# EAGLE board CFT-PB3-revC (EAGLE 7.6.0), part 1 of 2
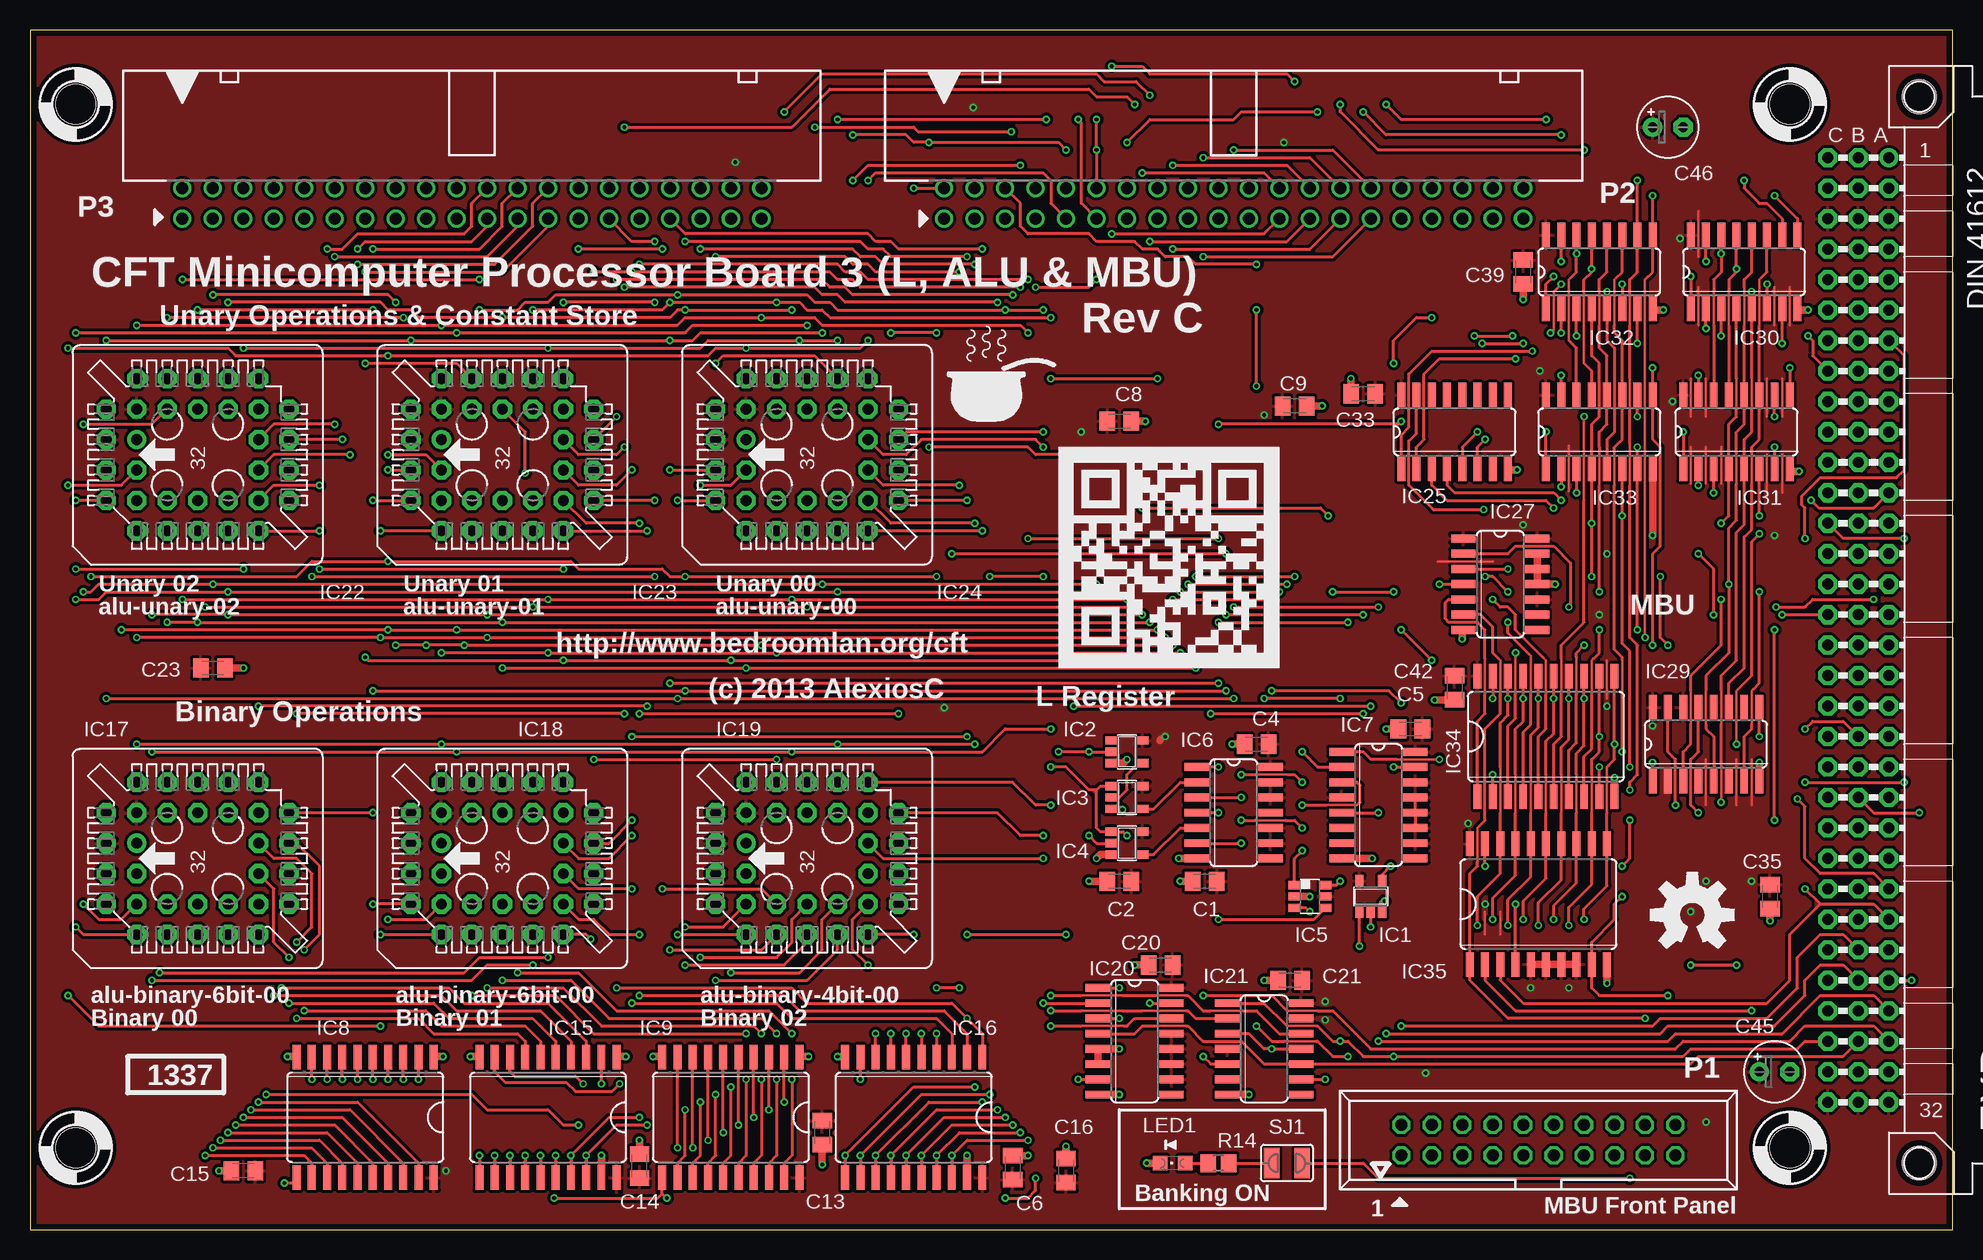
[diagram p7: board, top side]
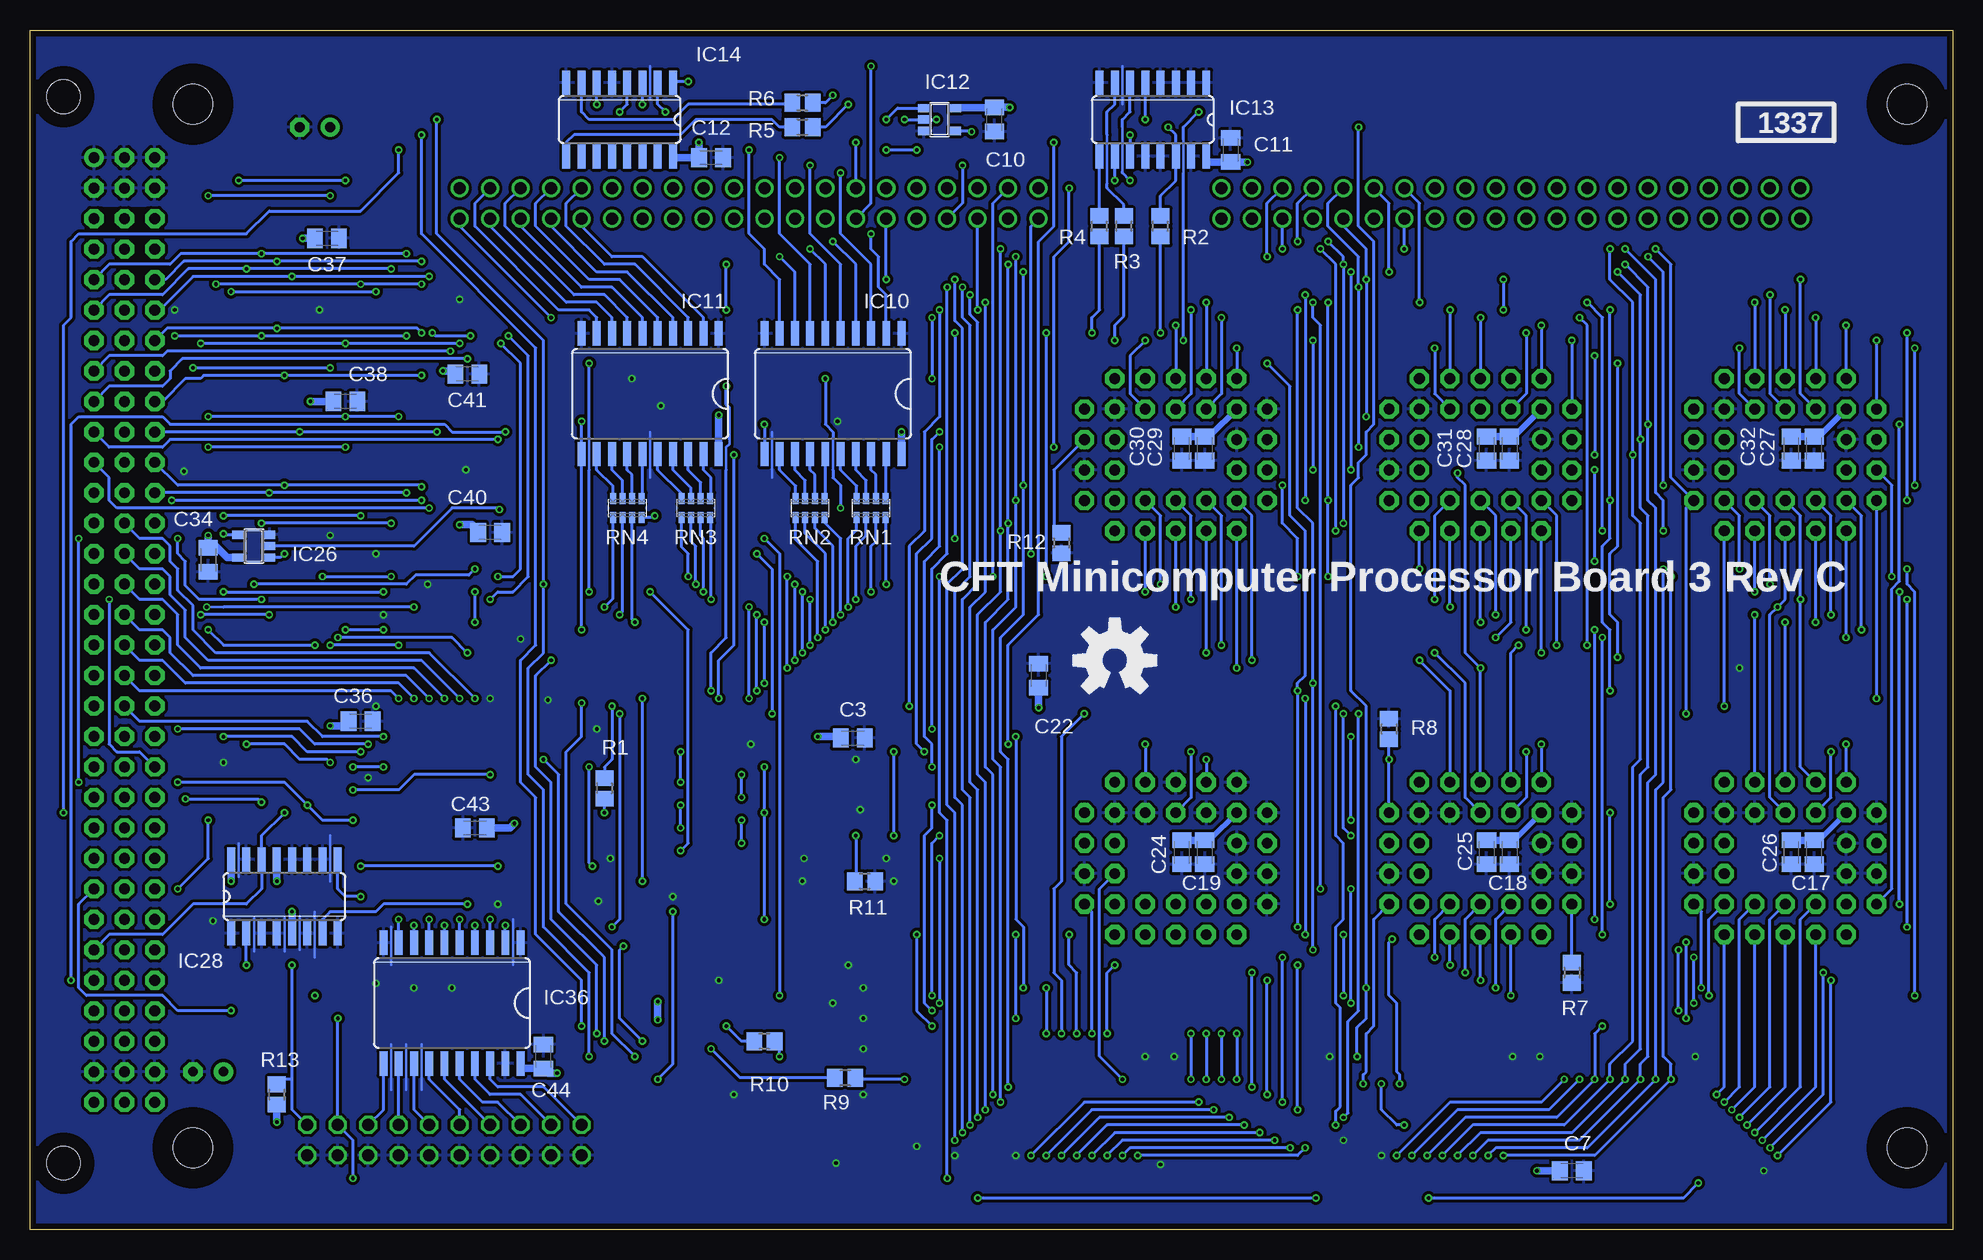
[diagram p8: board, bottom side, seen from below]

Size 160.27 x 100.03 mm. Coordinates in mm from the lower left corner, seen from the top.
Copper layers (1*16): Top 0.035mm / dielectric 1.5mm / Bottom 0.035mm
Design rules "smart-prototyping *": minimum track width 7mil, minimum drill 12mil, track to track 7mil, track to pad 7mil, pad to pad 7mil, via to via 7mil, smd to smd 0mil, copper to edge 20mil, drill to drill 10mil, minimum pad ring 10mil, minimum via ring 6mil, stop-mask expansion 2mil, vias tented up to drill 25mil, thermal gap 10mil
Net classes: 0 default: width 0.254 mm, clearance 0.152 mm; 1 Thin: width 0.203 mm, clearance 0.152 mm; 2 Power Rail: width 0.61 mm, clearance 0.152 mm
bRestrict: area 150.5,83.8 to 154.3,85.1

## Footprints (pad centres in the part's own frame; a part is rotated, then mirrored left to right if it is on the bottom)
C0805K = smd 1.3 x 1.6: 1 -1,0; 2 1,0
E2,5-5 = drill 0.813 pad 1.6 round: + -1.27,0 | drill 0.813 pad 1.6 octagon: - 1.27,0
VG96K = drill 0.914 pad 1.6 round: A1 154.94,39.37 | drill 0.914 pad 1.6 octagon: A2 154.94,36.83; A3 154.94,34.29; A4 154.94,31.75; A5 154.94,29.21; A6 154.94,26.67; A7 154.94,24.13; A8 154.94,21.59; A9 154.94,19.05; A10 154.94,16.51; A11 154.94,13.97; A12 154.94,11.43; A13 154.94,8.89; A14 154.94,6.35; A15 154.94,3.81; A16 154.94,1.27; A17 154.94,-1.27; A18 154.94,-3.81; A19 154.94,-6.35; A20 154.94,-8.89; A21 154.94,-11.43; A22 154.94,-13.97; A23 154.94,-16.51; A24 154.94,-19.05; A25 154.94,-21.59; A26 154.94,-24.13; A27 154.94,-26.67; A28 154.94,-29.21; A29 154.94,-31.75; A30 154.94,-34.29; A31 154.94,-36.83; A32 154.94,-39.37; B1 152.4,39.37; B2 152.4,36.83; B3 152.4,34.29; B4 152.4,31.75; B5 152.4,29.21; B6 152.4,26.67; B7 152.4,24.13; B8 152.4,21.59; B9 152.4,19.05; B10 152.4,16.51; B11 152.4,13.97; B12 152.4,11.43; B13 152.4,8.89; B14 152.4,6.35; B15 152.4,3.81; B16 152.4,1.27; B17 152.4,-1.27; B18 152.4,-3.81; B19 152.4,-6.35; B20 152.4,-8.89; B21 152.4,-11.43; B22 152.4,-13.97; B23 152.4,-16.51; B24 152.4,-19.05; B25 152.4,-21.59; B26 152.4,-24.13; B27 152.4,-26.67; B28 152.4,-29.21; B29 152.4,-31.75; B30 152.4,-34.29; B31 152.4,-36.83; B32 152.4,-39.37; C1 149.86,39.37; C2 149.86,36.83; C3 149.86,34.29; C4 149.86,31.75; C5 149.86,29.21; C6 149.86,26.67; C7 149.86,24.13; C8 149.86,21.59; C9 149.86,19.05; C10 149.86,16.51; C11 149.86,13.97; C12 149.86,11.43; C13 149.86,8.89; C14 149.86,6.35; C15 149.86,3.81; C16 149.86,1.27; C17 149.86,-1.27; C18 149.86,-3.81; C19 149.86,-6.35; C20 149.86,-8.89; C21 149.86,-11.43; C22 149.86,-13.97; C23 149.86,-16.51; C24 149.86,-19.05; C25 149.86,-21.59; C26 149.86,-24.13; C27 149.86,-26.67; C28 149.86,-29.21; C29 149.86,-31.75; C30 149.86,-34.29; C31 149.86,-36.83; C32 149.86,-39.37 | hole 2.794: 157.48,44.45; 157.48,-44.45
SOT23-5 = smd 0.69 x 0.99: 1 -0.95,-1.29; 2 0,-1.29; 3 0.95,-1.29; 4 0.95,1.3; 5 -0.95,1.3
DBV_R-PDSO-G6 = smd 0.69 x 0.99: 1 -0.95,-1.29; 2 0,-1.29; 3 0.95,-1.29; 4 0.95,1.3; 5 0,1.3; 6 -0.95,1.3
SO14 = smd 0.66 x 2.032: 1 -3.81,-3.073; 2 -2.54,-3.073; 3 -1.27,-3.073; 4 0,-3.073; 5 1.27,-3.073; 6 2.54,-3.073; 7 3.81,-3.073; 8 3.81,3.073; 9 2.54,3.073; 10 1.27,3.073; 11 0,3.073; 12 -1.27,3.073; 13 -2.54,3.073; 14 -3.81,3.073
SO16 = smd 0.66 x 2.032: 1 -4.445,-3.073; 2 -3.175,-3.073; 3 -1.905,-3.073; 4 -0.635,-3.073; 5 0.635,-3.073; 6 1.905,-3.073; 7 3.175,-3.073; 8 4.445,-3.073; 9 4.445,3.073; 10 3.175,3.073; 11 1.905,3.073; 12 0.635,3.073; 13 -0.635,3.073; 14 -1.905,3.073; 15 -3.175,3.073; 16 -4.445,3.073
SO20W = smd 0.66 x 2.032: 1 -5.715,-5.029; 2 -4.445,-5.029; 3 -3.175,-5.029; 4 -1.905,-5.029; 5 -0.635,-5.029; 6 0.635,-5.029; 7 1.905,-5.029; 8 3.175,-5.029; 9 4.445,-5.029; 10 5.715,-5.029; 11 5.715,5.029; 12 4.445,5.029; 13 3.175,5.029; 14 1.905,5.029; 15 0.635,5.029; 16 -0.635,5.029; 17 -1.905,5.029; 18 -3.175,5.029; 19 -4.445,5.029; 20 -5.715,5.029
PLCC32 = drill 0.9 pad 1.6 round: 1 1.27,5.08 | drill 0.9 pad 1.6 octagon: 2 -1.27,7.62; 3 -1.27,5.08; 4 -3.81,7.62; 5 -6.35,5.08; 6 -3.81,5.08; 7 -6.35,2.54; 8 -3.81,2.54; 9 -6.35,0; 10 -3.81,0; 11 -6.35,-2.54; 12 -3.81,-2.54; 13 -6.35,-5.08; 14 -3.81,-7.62; 15 -3.81,-5.08; 16 -1.27,-7.62; 17 -1.27,-5.08; 18 1.27,-7.62; 19 1.27,-5.08; 20 3.81,-7.62; 21 6.35,-5.08; 22 3.81,-5.08; 23 6.35,-2.54; 24 3.81,-2.54; 25 6.35,0; 26 3.81,0; 27 6.35,2.54; 28 3.81,2.54; 29 6.35,5.08; 30 3.81,7.62; 31 3.81,5.08; 32 1.27,7.62
CHIPLED_0805 = smd 1.2 x 1.2: A 0,-1.05; C 0,1.05
057-020-1 = drill 1 octagon: 1 -11.43,-1.27; 2 -11.43,1.27; 3 -8.89,-1.27; 4 -8.89,1.27; 5 -6.35,-1.27; 6 -6.35,1.27; 7 -3.81,-1.27; 8 -3.81,1.27; 9 -1.27,-1.27; 10 -1.27,1.27; 11 1.27,-1.27; 12 1.27,1.27; 13 3.81,-1.27; 14 3.81,1.27; 15 6.35,-1.27; 16 6.35,1.27; 17 8.89,-1.27; 18 8.89,1.27; 19 11.43,-1.27; 20 11.43,1.27
PAK100/2500-5-40 = drill 1 pad 1.422 round: 1 -24.13,-1.27; 2 -24.13,1.27; 3 -21.59,-1.27; 4 -21.59,1.27; 5 -19.05,-1.27; 6 -19.05,1.27; 7 -16.51,-1.27; 8 -16.51,1.27; 9 -13.97,-1.27; 10 -13.97,1.27; 11 -11.43,-1.27; 12 -11.43,1.27; 13 -8.89,-1.27; 14 -8.89,1.27; 15 -6.35,-1.27; 16 -6.35,1.27; 17 -3.81,-1.27; 18 -3.81,1.27; 19 -1.27,-1.27; 20 -1.27,1.27; 21 1.27,-1.27; 22 1.27,1.27; 23 3.81,-1.27; 24 3.81,1.27; 25 6.35,-1.27; 26 6.35,1.27; 27 8.89,-1.27; 28 8.89,1.27; 29 11.43,-1.27; 30 11.43,1.27; 31 13.97,-1.27; 32 13.97,1.27; 33 16.51,-1.27; 34 16.51,1.27; 35 19.05,-1.27; 36 19.05,1.27; 37 21.59,-1.27; 38 21.59,1.27; 39 24.13,-1.27; 40 24.13,1.27
R0805 = smd 1.3 x 1.5: 1 -0.85,0; 2 0.85,0
CTS742C083 = smd 0.5 x 0.9: 1 -1.2,-0.8; 2 -0.4,-0.8; 3 0.4,-0.8; 4 1.2,-0.8; 5 1.2,0.8; 6 0.4,0.8; 7 -0.4,0.8; 8 -1.2,0.8
SJW = smd 1.27 x 2.54: 1 -1.27,0; 2 1.27,0
STANDOFF_28_60 = hole 3.302: 0,0

## Placement (x,y rotation side)
$4_37_$  SIGNATURESILK  [SIGNATURE]  76.83,67.16 0 top
$4_39_$  OSHW-LOGOL  [OSHW-LOGO-L]  69.85,47.47 0 bottom
$4_39_$1  OSHW-LOGOL  [OSHW-LOGO-L]  138.56,26.26 0 top
$4_40_$  QRCODE-CFT  [CFT-QRCODE]  85.72,46.84 0 top
C1  0.1uF  [C0805K]  97.92,29.06 0 top
C2  0.1uF  [C0805K]  90.81,29.06 0 top
C3  0.1uF  [C0805K]  91.69,41 180 bottom
C4  0.1uF  [C0805K]  102.23,40.49 0 top
C5  0.1uF  [C0805K]  115.06,41.76 0 top
C6  0.1uF  [C0805K]  81.92,5.18 270 top
C7  0.1uF  [C0805K]  31.75,4.93 180 bottom
C8  0.1uF  [C0805K]  90.81,67.41 180 top
C9  0.1uF  [C0805K]  105.41,68.68 180 top
C10  0.1uF  [C0805K]  79.88,92.56 90 bottom
C11  0.1uF  [C0805K]  60.2,90.02 270 bottom
C12  0.1uF  [C0805K]  103.5,89.38 180 bottom
C13  0.1uF  [C0805K]  66.04,8.1 90 top
C14  0.1uF  [C0805K]  50.8,5.31 270 top
C15  1uF  [C0805K]  17.78,4.93 180 top
C16  1uF  [C0805K]  86.36,4.93 90 top
C17  0.1uF  [C0805K]  11.56,31.47 90 bottom
C18  0.1uF  [C0805K]  36.96,31.47 90 bottom
C19  0.1uF  [C0805K]  62.36,31.47 90 bottom
C20  0.1uF  [C0805K]  94.23,22.07 0 top
C21  0.1uF  [C0805K]  105.03,20.8 0 top
C22  1uF  [C0805K]  76.2,46.2 90 bottom
C23  1uF  [C0805K]  15.24,46.84 0 top
C24  1uF  [C0805K]  64.26,31.47 270 bottom
C25  1uF  [C0805K]  38.86,31.47 270 bottom
C26  1uF  [C0805K]  13.46,31.47 270 bottom
C27  0.1uF  [C0805K]  11.56,65.13 90 bottom
C28  0.1uF  [C0805K]  36.96,65.13 90 bottom
C29  0.1uF  [C0805K]  62.36,65.13 90 bottom
C30  1uF  [C0805K]  64.26,65.13 270 bottom
C31  1uF  [C0805K]  38.86,65.13 270 bottom
C32  1uF  [C0805K]  13.46,65.13 270 bottom
C33  0.1uF  [C0805K]  111.12,69.7 0 top
C34  0.1uF  [C0805K]  145.41,55.85 90 bottom
C35  0.1uF  [C0805K]  145.03,27.79 90 top
C36  0.1uF  [C0805K]  132.72,42.39 180 bottom
C37  0.1uF  [C0805K]  135.51,82.65 180 bottom
C38  0.1uF  [C0805K]  133.99,69.06 180 bottom
C39  0.1uF  [C0805K]  124.46,79.86 90 top
C40  0.1uF  [C0805K]  121.92,58.14 180 bottom
C41  0.1uF  [C0805K]  123.83,71.35 180 bottom
C42  0.1uF  [C0805K]  118.75,45.19 90 top
C43  0.1uF  [C0805K]  123.19,33.5 0 bottom
C44  0.1uF  [C0805K]  117.47,14.45 270 bottom
C45  47uF  [E2,5-5]  145.41,13.18 0 top
C46  47uF  [E2,5-5]  136.53,91.92 0 top
EXP  [VG96K]  0,50.01 0 top
IC1  74AHC1G08DBV  [SOT23-5]  111.76,27.79 0 top
IC2  74AHC1G04DBV  [SOT23-5]  91.44,39.85 270 top
IC3  74AHC1G08DBV  [SOT23-5]  91.44,36.04 270 top
IC4  74AHC1G00DBV  [SOT23-5]  91.44,32.23 270 top
IC5  741G10DBV  [DBV_R-PDSO-G6]  106.68,27.79 270 top
IC6  74HC32D  [SO14]  100.33,34.77 270 top
IC7  74HC112D  [SO16]  112.39,35.41 270 top
IC8  74HC574D  [SO20W]  27.94,9.37 180 top
IC9  74HC574D  [SO20W]  58.42,9.37 180 top
IC10  74HC574D  [SO20W]  93.34,69.7 180 bottom
IC11  74HC574D  [SO20W]  108.58,69.7 180 bottom
IC12  74AHC1G32DBV  [SOT23-5]  84.45,92.56 270 bottom
IC13  74HC253D  [SO16]  66.67,92.56 180 bottom
IC14  74HC138D  [SO16]  111.12,92.56 180 bottom
IC15  74HC541DW  [SO20W]  43.18,9.37 180 top
IC16  74HC541DW  [SO20W]  73.66,9.37 180 top
IC17  29F040  [PLCC32]  13.97,30.96 90 top
IC18  29F040  [PLCC32]  39.37,30.96 90 top
IC19  29F040  [PLCC32]  64.77,30.96 90 top
IC20  74HC253D  [SO16]  92.08,15.72 270 top
IC21  74HC74D  [SO14]  102.87,15.09 270 top
IC22  29F040  [PLCC32]  13.97,64.62 90 top
IC23  29F040  [PLCC32]  39.37,64.62 90 top
IC24  29F040  [PLCC32]  64.77,64.62 90 top
IC25  74HC138D  [SO16]  118.75,66.52 0 top
IC26  74AHC1G08DBV  [SOT23-5]  141.6,57 90 bottom
IC27  74HC74D  [SO14]  122.56,53.82 270 top
IC28  74HC253D  [SO16]  139.06,27.79 0 bottom
IC29  74HC139D  [SO16]  139.7,40.49 0 top
IC30  74HC670D  [SO16]  142.88,79.86 0 top
IC31  74HC670D  [SO16]  142.24,66.52 0 top
IC32  74HC670D  [SO16]  130.81,79.86 0 top
IC33  74HC670D  [SO16]  130.81,66.52 0 top
IC34  74HC541DW  [SO20W]  126.36,41.12 0 top
IC35  74HC541DW  [SO20W]  125.73,27.15 0 top
IC36  74HC541DW  [SO20W]  125.09,18.9 180 bottom
LED1  LED-5MM-GREEN  [CHIPLED_0805]  95.25,5.56 90 top
P1  057-020-1  [057-020-1]  125.73,7.47 0 top
P2  2540-5  [PAK100/2500-5-40]  100.33,85.57 0 top
P3  2540-5  [PAK100/2500-5-40]  36.83,85.57 0 top
R1  30R  [R0805]  112.39,36.8 270 bottom
R2  30R  [R0805]  66.04,83.67 90 bottom
R3  30R  [R0805]  69.09,83.67 90 bottom
R4  30R  [R0805]  71.12,83.67 90 bottom
R5  30R  [R0805]  95.89,91.92 0 bottom
R6  30R  [R0805]  95.89,93.95 0 bottom
R7  4k7  [R0805]  31.75,21.44 270 bottom
R8  4k7  [R0805]  46.99,41.76 90 bottom
R9  30R  [R0805]  92.33,12.67 180 bottom
R10  30R  [R0805]  99.06,15.72 180 bottom
R11  4k7  [R0805]  90.68,29.06 0 bottom
R12  4k7  [R0805]  74.3,57.25 270 bottom
R13  4k7  [R0805]  139.7,11.28 90 bottom
R14  330R  [R0805]  99.06,5.56 180 top
RN1  30R  [CTS742C083]  90.17,60.17 180 bottom
RN2  30R  [CTS742C083]  95.25,60.17 180 bottom
RN3  30R  [CTS742C083]  104.78,60.17 180 bottom
RN4  30R  [CTS742C083]  110.49,60.17 180 bottom
SJ1  [SJW]  104.78,5.56 180 top
U1  HOLE  [STANDOFF_28_60]  3.81,93.83 0 top
U2  HOLE  [STANDOFF_28_60]  3.81,6.83 0 top
U3  HOLE  [STANDOFF_28_60]  146.69,93.83 0 top
U4  HOLE  [STANDOFF_28_60]  146.69,6.83 0 top

## Tracks (layer width: path | path; a pad name or v marks a point on that pad's centre or on a via)
!ACCPL  (via drill 0.3)
  Top 0.254: v108.58,53.19 v113.67,53.19 | v113.67,72.24 113.67,74.14 115.57,76.05 v116.84,76.05 | IC5.1 105.41,28.76 105.41,30.96 v106.05,31.6
  Bottom 0.203: 113.67,63.35 113.67,66.01
  Bottom 0.254: v106.05,31.6 105.41,32.23 105.41,50.01 v108.58,53.19 | P2.39 124.46,83.67 v116.84,76.05 | 113.67,66.01 v113.67,72.24 | v113.67,53.19 113.67,63.35
!ALUCPL  (via drill 0.3)
  Top 0.203: 87.63,19.53 91.06,19.53 | 93.85,19.53 96.39,19.53 | 98.42,18.26 101.09,18.26
  Top 0.254: IC21.12 104.14,16.36 102.23,18.26 101.09,18.26 | v84.45,32.87 82.55,32.87 80.64,34.77 IC19.20 | v85.09,19.53 87.63,19.53 | 91.06,19.53 93.85,19.53 | 96.39,19.53 96.52,19.53 97.79,18.26 98.42,18.26
  Bottom 0.254: v85.09,19.53 85.09,32.23 v84.45,32.87
!BANKING
  Top 0.203: 121.28,44.68 121.28,47.6
  Top 0.254: IC34.1 120.65,42.39 121.28,43.03 121.28,44.68 | IC27.5 118.24,52.55 117.98,52.3 117.98,50.9 118.24,50.65 120.65,50.65 121.28,50.01 121.28,47.6
!BANKR0
  Top 0.203: 143.51,62.2 143.51,64.74 | 144.15,75.41 144.15,79.22 144.27,79.35
  Top 0.254: IC30.11 144.78,79.86 144.27,79.35 | 143.51,64.74 143.51,65.25 144.15,65.89 IC31.11 144.15,75.41 | 143.51,62.2 143.51,58.39 142.88,57.76 142.88,46.84 141.6,45.57 IC29.11
!BANKR1  (via drill 0.3)
  Top 0.203: 132.08,75.41 132.08,79.22 132.21,79.35 | 132.08,62.08 132.08,64.87 | 132.72,44.81 132.72,47.47
  Top 0.254: IC32.11 132.72,79.86 132.21,79.35 | 132.08,75.41 132.08,74.78 132.72,74.14 IC33.11 132.72,65.89 132.08,65.25 132.08,64.87 | v144.15,41.12 IC29.9 | 132.72,47.47 132.72,47.73 132.08,48.36 132.08,62.08 | v132.72,39.85 132.72,44.81
  Bottom 0.254: v132.72,39.85 137.16,39.85 138.43,41.12 v144.15,41.12
!BANKW0  (via drill 0.3)
  Top 0.203: 142.24,62.2 142.24,64.74 | 139.7,44.93 139.7,42.14 | 142.88,75.41 142.88,78.59
  Top 0.254: IC30.12 143.51,79.86 142.88,79.22 142.88,78.59 | 142.24,64.74 142.24,66.52 142.88,67.16 IC31.12 142.88,75.41 | 142.24,62.2 142.24,59.16 141.6,58.52 v141.6,53.82 141.6,48.11 139.7,46.2 139.7,44.93 | IC27.3 v123.19,55.09 | 139.7,42.14 139.7,41.76 140.34,41.12 IC29.5
  Bottom 0.254: v141.6,53.82 128.91,53.82 128.14,54.58 123.7,54.58 v123.19,55.09
!BANKW1  (via drill 0.3)
  Top 0.203: 143.51,42.14 143.51,44.93 143.64,45.06 | 130.81,75.41 130.81,78.33 | 130.81,62.08 130.81,65.25
  Top 0.254: IC32.12 131.44,79.86 130.81,79.22 130.81,78.33 | 130.81,75.41 130.81,73.51 131.44,72.87 IC33.12 131.44,67.16 130.81,66.52 130.81,65.25 130.81,64.87 | IC29.7 142.88,41.12 143.51,41.76 143.51,42.14 | 143.64,45.06 144.15,45.57 v144.15,53.19 | v130.81,53.19 130.81,62.08
  Bottom 0.254: v144.15,53.19 v130.81,53.19
!BOE  (via drill 0.3)
  Top 0.203: 87.63,16.99 91.19,16.99
  Top 0.254: IC20.14 92.08,17.63 91.44,16.99 91.19,16.99 | IC16.1 79.38,16.36 v78.11,17.63 76.83,18.9 64.77,18.9 63.5,20.17 v48.9,20.17 | IC15.1 48.95,14.45 | v49.53,91.92 63.5,91.92 66.67,95.1 88.27,95.1 88.9,94.46 91.44,94.46 v92.08,93.83 | v78.11,24.61 v86.36,24.61 | v85.09,16.99 87.63,16.99
  Top 0.61: 48.95,14.45 v49.66,14.45
  Bottom 0.254: v49.66,14.45 49.66,16.87 48.9,17.63 v48.9,20.17 48.9,43.66 50.16,44.93 50.16,62.08 49.53,62.71 49.53,63.98 48.9,64.62 48.9,66.52 48.26,67.16 48.26,82.4 49.53,83.67 v49.53,91.92 | R5.2 93.98,91.92 v92.08,93.83 | v86.36,24.61 86.36,18.26 v85.09,16.99 | v78.11,17.63 v78.11,24.61
!CLL  (via drill 0.3)
  Top 0.254: v76.83,56.36 v99.69,56.36 | v98.42,43.03 v111.12,43.03 | v111.76,25.25 IC1.2
  Bottom 0.254: v76.83,56.36 76.83,83.67 P2.1 | v99.69,56.36 98.42,55.09 v98.42,43.03 | v111.12,43.03 111.12,25.88 v111.76,25.25
!CPL  (via drill 0.3)
  Top 0.254: v73.66,86.84 P2.2 | v101.6,64.62 83.82,64.62 83.19,65.25 v74.93,65.25 | v109.22,44.3 v102.87,44.3 | v109.22,29.06 108.9,28.74 IC5.6
  Bottom 0.254: v73.66,86.84 73.66,82.4 74.93,81.13 v74.93,65.25 | v109.22,29.06 v109.22,44.3 | v102.87,44.3 102.87,47.47 101.6,48.74 v101.6,64.62
!FLTADD  (via drill 0.3)
  Top 0.254: IC5.3 106.36,26.84 v106.68,26.52 | IC21.9 v107.95,12.55
  Bottom 0.254: v106.68,26.52 106.68,13.82 v107.95,12.55
!FPRAM  (via drill 0.3)
  Top 0.254: v138.43,22.07 v142.24,22.07
  Bottom 0.254: v142.24,22.07 IC28.2 | 138.43,12.55 138.43,10.01 P1.20 | 138.43,12.55 139.7,12.55 R13.2 | 138.43,12.55 v138.43,22.07
!IRQS  (via drill 0.3)
  Top 0.203: 104.65,18.39 104.78,18.26 107.31,18.26
  Top 0.254: v8.89,75.41 v34.29,75.41 53.98,75.41 54.61,76.05 v60.96,76.05 65.41,76.05 66.04,75.41 82.55,75.41 v83.19,74.78 | 104.65,18.39 103.5,19.53 v97.79,19.53 | EXP.A30 153.67,16.99 147.96,16.99 146.69,15.72 137.79,15.72 137.16,15.09 111.76,15.09 108.58,18.26 107.31,18.26 | v83.19,57.63 v99.06,57.63
  Bottom 0.254: IC22.29 v8.89,75.41 | v34.29,75.41 IC23.29 | v60.96,76.05 60.96,69.7 IC24.28 | v99.06,57.63 97.79,56.36 v97.79,19.53 | v83.19,74.78 v83.19,57.63
!LCLR  (via drill 0.3)
  Top 0.254: v113.67,38.58 IC7.15 | v113.41,30.33 112.71,29.63 IC1.4
  Bottom 0.254: v113.67,38.58 113.67,30.58 v113.41,30.33
!MBUSEL  (via drill 0.3)
  Top 0.254: IC25.15 115.57,66.4 114.94,65.76 114.94,62.08 116.97,60.05 v121.16,60.05
  Bottom 0.254: v121.16,60.05 121.28,60.17 125.09,60.17 128.27,57 IC26.2
!MEM  (via drill 0.3)
  Top 0.254: v121.28,30.33 IC35.19 | IC29.15 136.53,39.85 137.16,39.22 v137.16,35.41 | EXP.C13 151.13,57.63 v156.21,57.63 | v147.96,37.31 v156.21,37.31 | v132.72,30.33 133.35,30.96 v133.35,34.14
  Bottom 0.254: v156.21,37.31 v156.21,57.63 | v147.96,37.31 139.06,37.31 v137.16,35.41 135.89,34.14 v133.35,34.14 | v121.28,30.33 v132.72,30.33
!RESET  (via drill 0.3)
  Top 0.203: 104.65,17.12 104.78,16.99 107.19,16.99
  Top 0.254: v110.81,23.66 IC1.1 | IC21.1 102.87,18.9 104.65,17.12 | EXP.C30 147.96,15.72 147.32,15.09 138.43,15.09 137.79,14.45 v113.67,14.45 111.12,14.45 109.86,15.72 v109.22,15.72 108.58,15.72 107.31,16.99 107.19,16.99 | v117.47,53.82 IC27.4 | v126.36,92.56 114.3,92.56 v113.03,93.83
  Bottom 0.254: v109.22,15.72 111.12,17.63 111.12,23.34 v110.81,23.66 | v113.67,14.45 113.67,21.44 117.47,25.25 117.47,36.68 118.75,37.95 118.75,46.84 117.47,48.11 v117.47,53.82 117.47,74.14 126.36,83.03 v126.36,92.56 | v113.03,93.83 IC14.6
!RSTHOLD  (via drill 0.3)
  Top 0.254: EXP.B22 153.67,34.77 v157.48,34.77 | v109.22,93.83 109.22,93.19 112.39,90.02 v129.54,90.02
  Bottom 0.254: v157.48,34.77 157.48,75.41 156.84,76.05 156.84,82.4 156.21,83.03 142.24,83.03 140.34,84.94 132.72,84.94 129.54,88.11 v129.54,90.02 | v109.22,93.83 IC14.3
!SYSDEV  (via drill 0.3)
  Top 0.254: IC25.5 119.38,65.25 v120.65,66.52 | EXP.A28 v156.84,20.8
  Bottom 0.254: v120.65,66.52 125.09,66.52 125.73,67.16 148.59,67.16 149.22,67.79 156.21,67.79 156.84,67.16 v156.84,20.8
!T34  (via drill 0.3)
  Top 0.254: EXP.B27 151.13,24.61 149.22,24.61 147.32,22.71 147.32,20.17 144.78,17.63 135.89,17.63 135.25,16.99 v114.3,16.99 | v111.12,93.19 113.03,91.29 v127.64,91.29
  Bottom 0.254: v127.64,91.29 127.64,83.03 118.11,73.51 118.11,48.74 119.38,47.47 119.38,37.31 118.11,36.04 118.11,24.61 114.3,20.8 v114.3,16.99 | v111.12,93.19 110.49,93.83 IC14.4
!UOE  (via drill 0.3)
  Top 0.254: v17.78,73.51 v43.18,73.51 55.88,73.51 56.52,74.14 v64.14,74.14 v67.31,74.14 | v62.87,93.19 66.04,96.37 88.9,96.37 89.53,95.73 92.2,95.73 v93.34,94.59
  Bottom 0.203: 64.14,88.11 64.14,90.91
  Bottom 0.254: IC22.24 17.78,69.7 v17.78,73.51 | IC23.24 43.18,69.7 v43.18,73.51 | v67.31,74.14 68.58,72.87 68.58,69.7 IC24.24 | R6.2 93.98,93.95 v93.34,94.59 | v64.14,74.14 64.14,88.11 | 64.14,90.91 64.14,91.92 v62.87,93.19
!W  (via drill 0.3)
  Top 0.254: v140.34,51.28 140.34,55.09 v139.06,56.36 | v146.05,51.28 EXP.C16
  Bottom 0.254: v140.34,51.28 v146.05,51.28 | IC26.1 139.38,56.05 v139.06,56.36
!WALU  (via drill 0.3)
  Top 0.254: v84.45,54.46 v80.01,54.46 | v81.28,2.64 83.19,2.64 83.82,3.28 v83.82,4.29 | 52.7,3.02 v53.09,2.64 | 52.7,3.02 IC9.11 | v43.69,2.64 52.32,2.64 52.7,3.02 | v21.21,3.91 22.23,3.91 IC8.11
  Bottom 0.254: v80.01,54.46 80.01,85.57 P2.4 | v83.82,4.29 83.82,34.14 84.45,34.77 v84.45,54.46 | v21.21,3.91 22.48,2.64 v43.69,2.64 | v53.09,2.64 v81.28,2.64
+3.3V
  Top 0.254: EXP.C4 EXP.B4 EXP.A4
A0  (via drill 0.3)
  Top 0.254: IC17.6 7.62,25.88 5.71,25.88 v4.45,27.15 | v4.45,53.19 5.08,53.19 5.71,53.82 v15.24,53.82 v66.04,53.82 v88.9,53.82
  Bottom 0.254: IC22.12 15.24,59.54 v15.24,53.82 | v4.45,27.15 v4.45,53.19 | IC24.12 66.04,59.54 v66.04,53.82 | RN1.8 88.9,59.3 v88.9,53.82
A1  (via drill 0.3)
  Top 0.254: v3.81,25.25 4.45,24.61 IC17.5 | v3.81,52.55 5.71,52.55 6.35,53.19 v16.51,53.19 v67.31,53.19 v90.17,53.19
  Bottom 0.254: v16.51,53.19 IC22.11 | v3.81,25.25 v3.81,52.55 | v67.31,53.19 IC24.11 | RN1.7 89.77,57.4 90.17,57 v90.17,53.19
A2  (via drill 0.3)
  Top 0.254: v12.7,52.55 v43.18,52.55 v63.5,52.55 v91.44,52.55
  Bottom 0.254: IC22.10 12.7,59.54 v12.7,52.55 12.7,38.58 IC17.27 | IC23.12 43.18,59.54 v43.18,52.55 | IC24.10 63.5,59.54 v63.5,52.55 | RN1.6 90.57,57.87 91.44,57 v91.44,52.55
A3  (via drill 0.3)
  Top 0.254: v14.61,51.92 v41.91,51.92 v64.77,51.92 v92.08,51.92
  Bottom 0.254: IC22.9 13.97,52.55 v14.61,51.92 15.24,51.28 15.24,36.04 IC17.26 | v64.77,51.92 IC24.9 | v41.91,51.92 IC23.11 | RN1.5 91.37,58.34 92.08,57.63 v92.08,51.92
A4  (via drill 0.3)
  Top 0.254: v10.16,51.28 v16.51,51.28 v38.1,51.28 v92.71,51.28
  Bottom 0.254: IC22.8 10.16,59.54 v10.16,51.28 | IC17.23 v16.51,51.28 | IC23.10 38.1,59.54 v38.1,51.28 | RN2.8 94.05,58.97 92.71,57.63 v92.71,51.28
A5  (via drill 0.3)
  Top 0.254: v11.43,50.65 v13.97,50.65 v39.37,50.65 v93.34,50.65
  Bottom 0.254: v11.43,50.65 IC22.7 | IC17.25 v13.97,50.65 | v39.37,50.65 IC23.9 | RN2.7 94.85,58.5 93.34,57 v93.34,50.65
A6  (via drill 0.3)
  Top 0.254: v7.62,50.01 v29.84,50.01 v35.56,50.01 v93.98,50.01 | IC18.6 33.02,25.88 v29.84,25.88
  Bottom 0.254: IC22.6 7.62,59.54 v7.62,50.01 | IC23.8 35.56,59.54 v35.56,50.01 | v29.84,25.88 v29.84,50.01 | RN2.6 95.65,58.03 93.98,56.36 v93.98,50.01
A7  (via drill 0.3)
  Top 0.254: v8.89,49.38 v29.21,49.38 v38.1,49.38 v94.61,49.38 | v29.21,24.61 IC18.5
  Bottom 0.254: v8.89,49.38 IC22.5 | v38.1,49.38 36.83,50.65 IC23.7 | v29.21,24.61 v29.21,49.38 | RN2.5 96.45,57.56 94.61,55.73 v94.61,49.38
A8  (via drill 0.3)
  Top 0.254: v95.25,48.74 v60.96,48.74 v36.2,48.74 v33.02,48.74 v30.48,48.74 | v95.25,52.55 v103.5,52.55 | v31.11,76.05 v11.43,76.05
  Bottom 0.254: IC23.6 33.02,59.54 v33.02,48.74 | IC18.27 36.83,48.11 v36.2,48.74 | IC24.8 60.96,59.54 v60.96,48.74 | v95.25,48.74 v95.25,52.55 | v11.43,76.05 IC22.27 | v30.48,48.74 30.48,75.41 v31.11,76.05 | v103.5,52.55 103.5,59.3 RN3.8
A9  (via drill 0.3)
  Top 0.254: v34.29,48.11 v43.18,48.11 v62.23,48.11 v95.89,48.11 | v95.89,53.19 v104.14,53.19 | v30.48,77.32 29.84,77.95 v15.24,77.95 | IC23.5 v29.21,58.27
  Bottom 0.254: v34.29,48.11 IC23.5 | IC18.26 40.64,36.04 40.64,45.57 v43.18,48.11 | v62.23,48.11 IC24.7 | v95.89,48.11 v95.89,53.19 | IC22.26 15.24,69.7 v15.24,77.95 | v29.21,58.27 29.21,76.05 v30.48,77.32 | RN3.7 104.38,57.87 104.14,57.63 v104.14,53.19
A10  (via drill 0.3)
  Top 0.254: v96.52,47.47 v58.42,47.47 v44.45,47.47 28.19,47.47 v27.94,47.73 | v96.52,53.82 v104.78,53.82 | IC23.27 35.56,72.24 v27.94,72.24
  Bottom 0.254: v44.45,47.47 41.91,44.93 IC18.23 | IC24.6 58.42,59.54 v58.42,47.47 | v96.52,47.47 v96.52,53.82 | v27.94,47.73 27.94,50.65 28.57,51.28 28.57,56.36 27.94,57 v27.94,72.24 | RN3.6 105.17,57.4 104.78,57 v104.78,53.82
A11  (via drill 0.3)
  Top 0.254: v39.37,46.84 v59.69,46.84 v97.16,46.84 | v97.16,54.46 v105.41,54.46 | IC23.26 41.27,66.52 v41.27,63.09
  Bottom 0.254: IC18.25 v39.37,46.84 40.64,48.11 40.64,62.08 41.27,62.71 v41.27,63.09 | v59.69,46.84 IC24.5 | v97.16,46.84 v97.16,54.46 | RN3.5 105.97,56.93 105.41,56.36 v105.41,54.46
A12  (via drill 0.3)
  Top 0.254: IC19.8 60.96,28.42 v52.7,28.42 | v41.91,76.68 52.7,76.68 v53.34,77.32 v62.23,77.32 64.14,77.32 64.77,76.68 66.04,76.68 66.67,76.05 v85.09,76.05 | v85.09,70.97 v93.98,70.97 | v92.71,60.17 107.57,60.17 v108.2,59.54
  Bottom 0.203: 93.34,66.01 93.34,63.35
  Bottom 0.254: v41.91,76.68 IC23.23 | v62.23,77.32 IC24.27 | v85.09,76.05 v85.09,70.97 | 93.34,63.35 93.34,62.71 92.71,62.08 v92.71,60.17 | 93.34,66.01 93.34,66.52 93.98,67.16 v93.98,70.97 | v108.2,59.54 108.37,59.37 RN4.8 | v52.7,28.42 52.7,75.41 53.34,76.05 v53.34,77.32
A13  (via drill 0.3)
  Top 0.254: v53.34,45.57 v99.06,45.57 | v99.06,50.65 v109.86,50.65 | v16.51,77.32 29.21,77.32 29.84,76.68 31.75,76.68 32.38,76.05 v39.37,76.05 53.34,76.05 53.98,76.68 v54.61,76.68 v63.5,76.68 | IC19.7 60.96,23.34 v53.34,23.34
  Bottom 0.254: v99.06,45.57 v99.06,50.65 | v16.51,77.32 IC22.23 | v39.37,76.05 IC23.25 | v53.34,23.34 v53.34,45.57 53.34,58.9 54.61,60.17 v54.61,76.68 | IC24.26 63.5,69.7 v63.5,76.68 | RN4.7 110.09,50.88 v109.86,50.65
A14  (via drill 0.3)
  Top 0.254: v99.69,51.28 v111.12,51.28 | v28.57,44.93 v54.61,44.93 v99.69,44.93 | v28.57,76.68 v13.97,76.68 | v28.57,60.81 IC23.4 | IC19.6 57.78,25.25 v54.61,25.25 | v57.15,72.24 57.78,72.87 65.41,72.87 IC24.23
  Bottom 0.254: v99.69,44.93 v99.69,51.28 | v13.97,76.68 IC22.25 | v28.57,44.93 28.57,50.01 29.21,50.65 29.21,57 28.57,57.63 v28.57,60.81 v28.57,76.68 | v54.61,25.25 v54.61,44.93 54.61,45.57 53.98,46.2 53.98,58.27 55.24,59.54 55.24,70.33 v57.15,72.24 | RN4.6 110.89,51.52 v111.12,51.28
A15  (via drill 0.3)
  Top 0.254: v6.35,44.3 v53.98,44.3 v100.33,44.3 | v100.33,51.92 v112.39,51.92 | IC22.4 v3.81,60.81 | v3.81,74.78 v35.56,74.78 54.61,74.78 55.24,75.41 v64.77,75.41 | v53.98,24.61 IC19.5
  Bottom 0.254: v6.35,44.3 IC22.4 | v100.33,44.3 v100.33,51.92 | v3.81,60.81 v3.81,74.78 | v35.56,74.78 35.56,69.7 IC23.28 | v53.98,44.3 v53.98,24.61 | v64.77,75.41 IC24.25 | RN4.5 111.69,52.62 v112.39,51.92
AB0  (via drill 0.3)
  Top 0.203: 128.4,74.02 128.27,74.14 128.27,79.22 128.4,79.35 | 140.34,78.21 140.34,75.41
  Top 0.254: IC32.14 v128.91,81.38 128.91,79.86 128.4,79.35 | 128.4,74.02 128.91,73.51 IC33.14 | IC30.14 v140.97,81.38 140.97,79.86 140.34,79.22 140.34,78.21 | 140.34,75.41 IC31.14
  Bottom 0.254: EXP.A5 153.67,80.49 148.59,80.49 147.7,81.38 v140.97,81.38 v128.91,81.38
AB1  (via drill 0.3)
  Top 0.203: 129.54,72.24 129.54,78.21 | 141.6,78.21 141.6,75.41
  Top 0.254: IC32.13 v130.18,80.11 130.18,79.86 129.54,79.22 129.54,78.21 | 129.54,72.24 130.18,71.6 IC33.13 | IC30.13 v142.24,80.11 142.24,79.86 141.6,79.22 141.6,78.21 | 141.6,75.41 IC31.13
  Bottom 0.254: EXP.A6 153.67,77.95 149.22,77.95 147.07,80.11 v142.24,80.11 v130.18,80.11
AB2  (via drill 0.3)
  Top 0.203: 138.43,42.14 138.43,44.93
  Top 0.254: IC29.3 137.79,39.85 138.43,40.49 138.43,42.14 | 138.43,44.93 138.43,46.2 140.97,48.74 v140.97,52.55 | EXP.A7 156.21,72.87 156.21,63.35 155.57,62.71 149.22,62.71 147.7,61.19 147.7,60.43 147.96,60.17 v147.96,57.63
  Bottom 0.254: v140.97,52.55 146.18,52.55 147.32,53.7 147.32,55.73 147.96,56.36 v147.96,57.63
AB3  (via drill 0.3)
  Top 0.254: IC25.1 114.3,66.27 114.94,66.9 114.94,71.35 116.84,73.25 v125.22,73.25
  Bottom 0.254: v125.22,73.25 148.84,73.25 149.22,72.87 153.67,72.87 EXP.A8
AB4  (via drill 0.3)
  Top 0.254: IC25.2 115.57,65.25 116.2,65.89 116.2,71.35 117.47,72.62 v123.83,72.62
  Bottom 0.254: v123.83,72.62 147.57,72.62 148.59,71.6 148.59,70.97 149.22,70.33 153.67,70.33 EXP.A9
AB5  (via drill 0.3)
  Top 0.254: IC25.6 120.65,65.25 v121.28,65.89
  Bottom 0.254: v121.28,65.89 148.59,65.89 149.22,65.25 153.67,65.25 EXP.A10
AB6  (via drill 0.3)
  Top 0.254: IC25.3 116.84,62.08 118.11,60.81 126.36,60.81 v127,60.17
  Bottom 0.254: v127,60.17 153.03,60.17 153.67,60.81 153.67,62.71 EXP.A11
AB7  (via drill 0.3)
  Top 0.254: IC25.4 118.11,62.08 118.75,61.44 127,61.44 v127.64,60.81 | EXP.A12 153.67,60.17 149.1,60.17 v148.46,60.81
  Bottom 0.254: v127.64,60.81 v148.46,60.81
AB13  (via drill 0.3)
  Top 0.203: 143.51,68.43 143.51,70.97 | v140.97,35.66 140.97,38.84 | 140.97,42.14 140.97,44.93
  Top 0.254: IC35.2 121.28,20.8 123.83,18.26 v143.51,18.26 | v131.44,78.21 IC32.5 131.44,74.14 132.08,73.51 132.08,66.52 131.44,65.89 IC33.5 | v143.51,78.21 IC30.5 143.51,70.97 | 140.97,44.93 140.97,46.2 142.24,47.47 142.24,58.14 142.88,58.78 IC31.5 142.88,65.89 143.51,66.52 143.51,68.43 | v147.32,35.92 147.96,35.28 147.96,30.96 149.22,29.69 153.67,29.69 EXP.A25 | 140.97,38.84 140.97,42.14
  Bottom 0.254: v143.51,18.26 147.96,18.26 149.22,19.53 155.57,19.53 156.21,20.17 156.21,27.15 EXP.A25 | v143.51,78.21 v131.44,78.21 | v147.32,35.92 141.22,35.92 v140.97,35.66
AB14  (via drill 0.3)
  Top 0.203: 142.24,68.43 142.24,70.97
  Top 0.254: IC35.3 122.56,20.8 124.46,18.9 144.78,18.9 146.69,20.8 146.69,24.61 149.22,27.15 | IC32.4 130.18,72.87 130.81,72.24 130.81,67.79 130.18,67.16 IC33.4 v130.18,58.9 v130.18,54.46 | v140.97,58.9 141.6,59.54 IC31.4 141.6,67.16 142.24,67.79 142.24,68.43 | EXP.A26 153.67,27.15 149.22,27.15 | v135.89,54.46 135.89,49.38 v136.53,48.74 | v145.41,34.14 v145.41,50.01 | 149.22,27.15 v147.96,28.42 | 142.24,70.97 IC30.4
  Bottom 0.254: v130.18,58.9 v140.97,58.9 | v135.89,54.46 v130.18,54.46 | v136.53,48.74 144.15,48.74 v145.41,50.01 | v147.96,28.42 145.41,30.96 v145.41,34.14
  pour Top (isolate 0.254): 148.84,27.53 148.84,26.77 149.22,27.15
AB15  (via drill 0.3)
  Top 0.254: v139.06,34.77 138.43,35.41 138.43,39.22 139.06,39.85 IC29.13
  Bottom 0.254: EXP.A27 153.67,24.61 149.22,24.61 146.69,27.15 142.24,27.15 140.97,28.42 IC28.14 140.97,32.87 v139.06,34.77
AC0  (via drill 0.3)
  Top 0.254: v90.17,83.03 102.87,83.03 P2.23
  Bottom 0.254: IC10.2 88.9,77.95 89.53,78.59 89.53,81.13 90.17,81.76 v90.17,83.03
AC1  (via drill 0.3)
  Top 0.254: v92.71,88.11 102.87,88.11 P2.24
  Bottom 0.254: v92.71,88.11 92.71,83.03 90.17,80.49 IC10.3
AC2  (via drill 0.3)
  Top 0.254: v93.34,82.4 104.78,82.4 P2.25
  Bottom 0.254: IC10.4 91.44,80.49 v93.34,82.4
AC3  (via drill 0.3)
  Top 0.254: v95.25,88.75 104.78,88.75 P2.26
  Bottom 0.254: v95.25,88.75 95.25,83.03 92.71,80.49 IC10.5
AC4  (via drill 0.3)
  Top 0.254: v95.25,81.76 106.68,81.76 P2.27
  Bottom 0.254: IC10.6 93.98,80.49 v95.25,81.76
AC5  (via drill 0.3)
  Top 0.254: v97.79,89.38 106.68,89.38 P2.28
  Bottom 0.254: v97.79,89.38 97.79,83.03 95.25,80.49 IC10.7
AC6  (via drill 0.3)
  Top 0.254: v97.79,81.13 108.58,81.13 P2.29
  Bottom 0.254: IC10.8 96.52,79.86 v97.79,81.13
AC7  (via drill 0.3)
  Top 0.254: v100.33,90.02 108.58,90.02 P2.30
  Bottom 0.254: v100.33,90.02 100.33,83.03 99.06,81.76 99.06,80.49 97.79,79.22 IC10.9
AC8
  Bottom 0.254: IC11.2 104.14,76.05 109.22,81.13 111.76,81.13 114.3,83.67 P2.31
AC9
  Bottom 0.254: IC11.3 105.41,76.05 109.86,80.49 112.39,80.49 115.57,83.67 115.57,85.57 P2.32
AC10
  Bottom 0.254: IC11.4 106.68,76.05 110.49,79.86 113.03,79.86 116.84,83.67 P2.33
AC11
  Bottom 0.254: IC11.5 107.95,76.05 111.12,79.22 113.67,79.22 118.11,83.67 118.11,85.57 P2.34
AC12
  Bottom 0.254: IC11.6 109.22,76.05 111.76,78.59 114.3,78.59 119.38,83.67 P2.35
AC13
  Bottom 0.254: IC11.7 110.49,76.05 112.39,77.95 114.94,77.95 120.65,83.67 120.65,85.57 P2.36
AC14
  Bottom 0.254: IC11.8 111.76,76.05 113.03,77.32 115.57,77.32 121.92,83.67 P2.37
AC15
  Bottom 0.254: IC11.9 113.03,76.05 113.67,76.68 116.2,76.68 123.19,83.67 123.19,85.57 P2.38
AE'0  (via drill 0.3)
  Top 0.203: 133.35,62.08 133.35,65.51 | 133.35,68.3 133.35,70.97 | 133.35,75.41 133.35,78.08
  Top 0.254: v133.99,87.48 IC32.10 133.99,79.86 133.35,79.22 133.35,78.08 | v142.88,87.48 142.88,86.84 144.15,85.57 144.78,85.57 146.05,84.3 IC30.10 | IC34.2 v121.92,37.95 | v133.35,36.68 133.35,37.31 133.99,37.95 133.99,48.74 133.35,49.38 133.35,62.08 | 133.35,65.51 133.35,68.3 | 133.35,70.97 133.35,75.41
  Bottom 0.254: v133.99,87.48 v142.88,87.48 | v121.92,37.95 128.27,37.95 129.54,36.68 v133.35,36.68
AE'1  (via drill 0.3)
  Top 0.203: v134.62,49.38 134.62,79.22 | 123.83,44.68 v123.83,48.11
  Top 0.254: IC34.3 123.19,42.01 123.83,42.65 123.83,44.68 | v135.25,86.21 IC32.9 135.25,79.86 134.62,79.22 | v145.41,86.21 147.32,84.3 IC30.9
  Bottom 0.254: v135.25,86.21 v145.41,86.21 | v134.62,49.38 125.09,49.38 v123.83,48.11
AE'2  (via drill 0.3)
  Top 0.203: 124.97,47.98 125.09,47.85 125.09,44.68
  Top 0.254: IC34.4 124.46,41.5 125.09,42.14 125.09,44.68 | v133.99,73.89 IC32.7 | v146.05,73.89 IC30.7 | v121.28,54.46 121.92,54.46 v123.19,53.19 | 124.97,47.98 123.19,49.76 v123.19,50.65 | v121.03,73.89 v124.46,73.89
  Bottom 0.254: v146.05,73.89 v133.99,73.89 v124.46,73.89 | v123.19,50.65 v123.19,53.19 | v121.28,54.46 120.02,54.46 119.38,55.09 119.38,72.24 v121.03,73.89
AE'3  (via drill 0.3)
  Top 0.203: 127,75.03 127,78.21 | 126.11,47.73 126.36,47.47 126.36,44.68
  Top 0.254: v144.78,78.84 IC30.6 | v132.72,78.84 IC32.6 | IC34.5 125.73,41.12 126.36,41.76 126.36,44.68 | v120.4,74.52 v123.57,74.52 | v126.75,74.78 127,75.03 | 127,78.21 v127.64,78.84 | 126.11,47.73 123.83,50.01 123.83,51.28 123.19,51.92 122.56,51.92 v121.92,52.55
  Bottom 0.254: v144.78,78.84 v132.72,78.84 v127.64,78.84 | v121.92,52.55 121.28,53.19 120.02,53.19 118.75,54.46 118.75,72.87 v120.4,74.52 | v123.57,74.52 126.49,74.52 v126.75,74.78
AE'4  (via drill 0.3)
  Top 0.203: 129.54,60.81 v129.54,67.79 | 127.64,44.68 127.64,47.6
  Top 0.254: IC34.6 127,40.49 127.64,41.12 127.64,44.68 | v133.99,67.79 IC33.10 | v145.41,67.79 IC31.10 | 127.64,47.6 127.64,48.74 129.54,50.65 129.54,60.81
  Bottom 0.254: v145.41,67.79 v133.99,67.79 v129.54,67.79
AE'5  (via drill 0.3)
  Top 0.203: 128.91,44.68 128.91,47.73
  Top 0.254: IC34.7 128.27,39.98 128.91,40.61 128.91,44.68 | 128.91,47.73 128.91,48.11 v129.54,48.74 | v135.25,71.86 IC33.9 135.25,65.89 135.89,65.25 135.89,57 135.25,56.36 v135.25,48.74 | v146.69,71.86 IC31.9
  Bottom 0.254: v135.25,71.86 v146.69,71.86 | v129.54,48.74 v135.25,48.74
AE'6  (via drill 0.3)
  Top 0.203: 130.3,47.6 130.18,47.47 130.18,44.68
  Top 0.254: v145.41,65.25 IC31.7 | v133.99,65.25 IC33.7 v133.99,50.01 | IC34.8 129.54,39.47 130.18,40.11 130.18,44.68 | 130.3,47.6 130.81,48.11 v130.81,50.01
  Bottom 0.254: v133.99,65.25 v145.41,65.25 | v130.81,50.01 v133.99,50.01
AE'7  (via drill 0.3)
  Top 0.254: IC33.6 v132.72,59.54 132.72,48.87 133.35,48.23 v133.35,38.58 | v144.15,59.54 IC31.6 | v130.81,38.58 IC34.9 130.81,36.04
  Bottom 0.254: v132.72,59.54 v144.15,59.54 | v130.81,38.58 v133.35,38.58
AEXT0  (via drill 0.3)
  Top 0.203: 122.56,34.77 122.56,38.58
  Top 0.254: v120.65,25.37 120.65,27.79 122.56,29.69 IC35.18 122.56,34.77 | IC34.18 v123.19,44.3 123.19,42.9 122.56,42.27 122.56,38.58
  Bottom 0.254: IC36.2 v120.65,25.37 | EXP.B13 151.13,57.63 149.22,57.63 148.59,57 148.59,55.73 147.96,55.09 147.96,53.31 146.69,52.04 146.69,50.01 144.78,48.11 127,48.11 v123.19,44.3
AEXT1  (via drill 0.3)
  Top 0.203: 123.83,34.77 123.83,37.95
  Top 0.254: v121.92,25.88 121.92,27.66 123.83,29.57 IC35.17 123.83,34.77 | IC34.17 v124.46,44.3 124.46,42.39 123.83,41.76 123.83,37.95
  Bottom 0.254: IC36.3 v121.92,25.88 | EXP.B14 151.13,55.09 149.22,55.09 148.59,54.46 148.59,52.93 147.32,51.66 147.32,49.38 145.41,47.47 127.64,47.47 v124.46,44.3
AEXT2  (via drill 0.3)
  Top 0.203: 125.09,34.77 125.09,37.95
  Top 0.254: v123.19,25.37 123.19,27.53 125.09,29.44 IC35.16 125.09,34.77 | IC34.16 v125.73,44.3 125.73,41.88 125.09,41.25 125.09,37.95
  Bottom 0.254: IC36.4 v123.19,25.37 | EXP.B15 151.13,52.55 149.22,52.55 147.96,51.28 147.96,48.74 146.05,46.84 128.27,46.84 v125.73,44.3
AEXT3  (via drill 0.3)
  Top 0.203: 126.36,34.77 126.36,37.95
  Top 0.254: v124.46,25.88 124.46,27.41 126.36,29.31 IC35.15 126.36,34.77 | IC34.15 v127,44.3 127,41.38 126.36,40.74 126.36,37.95
  Bottom 0.254: IC36.5 v124.46,25.88 | EXP.B16 151.13,50.01 149.22,50.01 148.59,49.38 148.59,48.11 146.69,46.2 128.91,46.2 v127,44.3
AEXT4  (via drill 0.3)
  Top 0.203: 127.64,34.77 127.64,37.95
  Top 0.254: v125.73,25.37 125.73,27.28 127.64,29.18 IC35.14 127.64,34.77 | IC34.14 v128.27,44.3 128.27,40.87 127.64,40.23 127.64,37.95
  Bottom 0.254: IC36.6 v125.73,25.37 | EXP.B17 151.13,47.47 149.22,47.47 147.32,45.57 129.54,45.57 v128.27,44.3
AEXT5  (via drill 0.3)
  Top 0.203: 128.91,34.77 128.91,37.95
  Top 0.254: v127,25.88 127,27.03 128.91,28.93 IC35.13 128.91,34.77 | IC34.13 v129.54,44.3 129.54,40.36 128.91,39.73 128.91,37.95
  Bottom 0.254: IC36.7 v127,25.88 | EXP.B18 151.13,44.93 130.18,44.93 v129.54,44.3
AEXT6  (via drill 0.3)
  Top 0.203: 130.18,34.77 130.18,37.95
  Top 0.254: v128.27,25.37 128.27,26.9 130.18,28.8 IC35.12 130.18,34.77 | IC34.12 v130.81,41.12 130.81,39.85 130.18,39.22 130.18,37.95
  Bottom 0.254: IC36.8 v128.27,25.37 | EXP.B19 151.13,42.39 137.16,42.39 135.89,41.12 v130.81,41.12
AEXT7  (via drill 0.3)
  Top 0.203: 131.44,34.77 131.44,38.58 131.57,38.71
  Top 0.254: v129.54,25.88 129.54,26.77 131.44,28.68 IC35.11 131.44,34.77 | IC34.11 v132.08,40.49 132.08,39.22 131.57,38.71 | v147.96,41.76 148.59,42.39 151.13,42.39 EXP.B20
  Bottom 0.254: IC36.9 v129.54,25.88 | v132.08,40.49 136.53,40.49 137.79,41.76 v147.96,41.76
B0  (via drill 0.3)
  Top 0.254: v19.05,10.64 27.3,10.64 32.38,5.56 IC8.19
  Bottom 0.254: IC17.12 17.78,25.88 17.78,11.91 v19.05,10.64
B1  (via drill 0.3)
  Top 0.254: v18.41,10.01 26.67,10.01 31.11,5.56 IC8.18
  Bottom 0.254: v18.41,10.01 16.51,11.91 IC17.11
B2  (via drill 0.3)
  Top 0.254: v17.78,9.37 26.04,9.37 29.84,5.56 IC8.17
  Bottom 0.254: IC17.10 15.24,25.88 15.24,11.91 v17.78,9.37
B3  (via drill 0.3)
  Top 0.254: v17.14,8.74 25.4,8.74 28.57,5.56 IC8.16
  Bottom 0.254: v17.14,8.74 13.97,11.91 IC17.9
B4  (via drill 0.3)
  Top 0.254: v16.51,8.1 24.77,8.1 27.3,5.56 IC8.15
  Bottom 0.254: IC17.8 12.7,25.88 12.7,11.91 v16.51,8.1
B5  (via drill 0.3)
  Top 0.254: v15.88,7.47 24.13,7.47 26.04,5.56 IC8.14
  Bottom 0.254: v15.88,7.47 11.43,11.91 IC17.7
B6  (via drill 0.3)
  Top 0.254: IC8.13 24.77,5.56 23.5,6.83 v15.24,6.83 | v10.79,21.44 36.2,21.44 37.47,22.71 v43.18,22.71
  Bottom 0.254: v15.24,6.83 10.79,11.28 v10.79,21.44 | v43.18,22.71 43.18,25.88 IC18.12
B7  (via drill 0.3)
  Top 0.254: v41.91,22.07 38.1,22.07 36.83,20.8 v10.16,20.8 | v14.61,6.2 22.86,6.2 23.5,5.56 IC8.12
  Bottom 0.254: v41.91,22.07 IC18.11 | v14.61,6.2 10.16,10.64 v10.16,20.8
B8  (via drill 0.3)
  Top 0.254: IC9.19 62.87,5.56 63.5,6.2 v63.5,12.55 | v40.64,21.44 45.72,21.44 48.9,18.26 61.59,18.26 v63.5,16.36
  Bottom 0.254: IC18.10 40.64,25.88 v40.64,21.44 | v63.5,16.36 v63.5,12.55
B9  (via drill 0.3)
  Top 0.254: IC9.18 61.59,5.56 62.23,6.2 v62.23,12.55 | v39.37,20.8 45.09,20.8 48.26,17.63 60.96,17.63 v62.23,16.36
  Bottom 0.254: v39.37,20.8 IC18.9 | v62.23,16.36 v62.23,12.55
B10  (via drill 0.3)
  Top 0.254: IC9.17 60.33,5.56 60.96,6.2 v60.96,12.55 | v38.1,20.17 44.45,20.17 47.62,16.99 60.33,16.99 v60.96,16.36
  Bottom 0.254: IC18.8 38.1,25.88 v38.1,20.17 | v60.96,16.36 v60.96,12.55
B11  (via drill 0.3)
  Top 0.254: IC9.16 59.05,5.56 59.69,6.2 v59.69,12.55 | v36.83,19.53 43.81,19.53 46.99,16.36 v59.69,16.36
  Bottom 0.254: v36.83,19.53 IC18.7 | v59.69,16.36 v59.69,12.55
B12  (via drill 0.3)
  Top 0.254: IC9.15 57.78,5.56 58.42,6.2 v58.42,11.91 | IC19.12 66.04,25.88 66.04,23.34 64.14,21.44 v58.42,21.44
  Bottom 0.254: v58.42,11.91 v58.42,21.44
B13  (via drill 0.3)
  Top 0.254: IC9.14 56.52,5.56 57.15,6.2 v57.15,11.28 | IC19.11 67.31,23.34 64.77,20.8 v57.15,20.8
  Bottom 0.254: v57.15,11.28 v57.15,20.8
B14  (via drill 0.3)
  Top 0.254: IC9.13 55.24,5.56 55.88,6.2 v55.88,10.64 | IC19.10 63.5,25.88 63.5,23.98 62.23,22.71 v55.88,22.71
  Bottom 0.254: v55.88,10.64 v55.88,22.71
B15  (via drill 0.3)
  Top 0.254: IC9.12 53.98,5.56 54.61,6.2 v54.61,10.01 | IC19.9 64.77,23.98 62.87,22.07 v54.61,22.07
  Bottom 0.254: v54.61,10.01 v54.61,22.07
BANK0
  Bottom 0.254: IC36.18 121.92,12.55 121.28,11.91 117.47,11.91 P1.2
BANK1
  Bottom 0.254: IC36.17 123.19,12.55 121.92,11.28 119.38,11.28 P1.4
BANK2
  Bottom 0.254: IC36.16 124.46,12.55 122.56,10.64 121.28,10.64 P1.6
BANK3
  Bottom 0.254: IC36.15 125.73,12.55 P1.8
BANK4
  Bottom 0.254: IC36.14 127,12.55 124.46,10.01 P1.10
BANK5
  Bottom 0.254: IC36.13 128.27,10.01 P1.12
BANK6
  Bottom 0.254: P1.14 IC36.12
BANK7
  Bottom 0.254: IC36.11 130.81,10.01 P1.16
BANKING  (via drill 0.3)
  Top 0.203: 120.65,30.71 120.65,33.5 120.78,33.63 | 122.43,47.6 122.56,47.47 122.56,44.68
  Top 0.254: v134.62,17.63 123.19,17.63 120.02,20.8 IC35.1 120.02,29.69 120.65,30.33 120.65,30.71 | 120.78,33.63 121.28,34.14 121.28,41.76 122.56,43.03 122.56,44.68 | 122.43,47.6 121.92,48.11 121.92,50.27 120.9,51.28 IC27.6 | SJ1.1 111.12,5.56 112.39,4.29 v133.35,4.29
  Bottom 0.254: v134.62,17.63 P1.18 133.35,7.47 v133.35,4.29
CLK1  (via drill 0.3)
  Top 0.203: v117.47,39.22 113.92,39.22
  Top 0.254: IC7.1 111.12,39.85 111.76,39.22 113.92,39.22 | EXP.A29 153.67,19.53 149.22,19.53 146.05,16.36 137.16,16.36 136.53,15.72 v112.39,15.72
  Bottom 0.254: v112.39,15.72 112.39,22.71 116.2,26.52 116.2,37.95 v117.47,39.22
CLK3
  Top 0.203: 93.85,16.99 96.39,16.99
  Top 0.254: IC20.4 92.08,16.36 92.71,16.99 93.85,16.99 | EXP.B30 151.13,14.45 139.06,14.45 138.43,13.82 IC21.10 102.87,13.82 100.97,15.72 97.79,15.72 96.52,16.99 96.39,16.99
CLK4  (via drill 0.3)
  Top 0.254: v114.3,67.41 114.05,67.16 v99.06,67.16 | v113.03,16.36 135.89,16.36 136.53,16.99 145.41,16.99 147.96,19.53 147.96,20.8 149.22,22.07 151.13,22.07 EXP.B28 | v116.84,47.47 v114.3,50.01
  Bottom 0.254: v113.03,16.36 113.03,22.07 116.84,25.88 116.84,37.31 118.11,38.58 118.11,46.2 v116.84,47.47 | v99.06,67.16 IC10.11 | v114.3,50.01 IC11.11 v114.3,67.41
CO1  (via drill 0.3)
  Top 0.254: v28.57,34.77 IC17.20 | IC18.4 v28.57,27.15
  Bottom 0.254: v28.57,27.15 v28.57,34.77 | R7.1 IC18.4
CO2  (via drill 0.3)
  Top 0.254: v46.99,39.22 v62.23,39.22
  Bottom 0.254: IC18.20 v46.99,39.22 R8.1 | v62.23,39.22 IC19.27
DB0  (via drill 0.3)
  Top 0.254: v139.7,80.75 IC30.15 | v127.64,80.75 IC32.15
  Bottom 0.254: v127.64,80.75 v139.7,80.75 147.45,80.75 148.97,79.22 EXP.C5
DB1  (via drill 0.3)
  Top 0.254: IC32.1 126.36,78.84 v127,79.48 | v138.43,79.48 IC30.1
  Bottom 0.254: v127,79.48 v138.43,79.48 146.69,79.48 149.48,76.68 EXP.C6
DB2  (via drill 0.3)
  Top 0.254: v127.64,74.78 IC32.2 | v139.7,75.16 IC30.2
  Bottom 0.254: v127.64,74.78 128.02,75.16 v139.7,75.16 148.84,75.16 EXP.C7
DB3  (via drill 0.3)
  Top 0.254: v128.91,74.52 IC32.3 | v140.97,74.52 IC30.3 | EXP.C8 148.59,72.87 148.59,74.14 v148.21,74.52
  Bottom 0.254: v128.91,74.52 v140.97,74.52 v148.21,74.52
DB4  (via drill 0.3)
  Top 0.254: IC33.15 v127.64,71.22 | v139.06,71.22 IC31.15
  Bottom 0.254: v127.64,71.22 v139.06,71.22 145.8,71.22 146.05,70.97 147.32,70.97 149.22,69.06 EXP.C9
DB5  (via drill 0.3)
  Top 0.254: IC33.1 v126.36,66.52 | v137.79,66.52 IC31.1
  Bottom 0.254: EXP.C10 v137.79,66.52 v126.36,66.52
DB6  (via drill 0.3)
  Top 0.254: IC33.2 v127.64,61.95 | v139.06,62.08 IC31.2
  Bottom 0.254: EXP.C11 147.96,62.08 v139.06,62.08 127.76,62.08 v127.64,61.95
DB7  (via drill 0.3)
  Top 0.254: IC33.3 v128.91,61.44 | v140.34,61.44 IC31.3
  Bottom 0.254: v128.91,61.44 v140.34,61.44 EXP.C12
DB8  (via drill 0.3)
  Top 0.254: IC27.2 123.19,56.36 123.83,57 127,57 128.4,55.6 128.4,52.04 v128.27,51.92 | v153.67,52.55 148.59,52.55 147.96,51.92 v145.54,51.92
  Bottom 0.203: 144.15,51.92 v145.54,51.92
  Bottom 0.254: v128.27,51.92 144.15,51.92 | v153.67,52.55 153.67,40.49 153.03,39.85 151.13,39.85 EXP.C21
FL  (via drill 0.3)
  Top 0.254: v4.45,67.16 10.16,67.16 IC22.28 | v53.98,60.81 IC24.4 | v12.7,79.22 v37.47,79.22 | v84.45,76.68 v81.28,76.68 67.31,76.68 66.67,77.32 65.41,77.32 64.77,77.95 v53.98,77.95 43.81,77.95 43.18,77.32 41.27,77.32 40.64,76.68 v37.47,76.68 | v87,43.66 v111.76,43.66
  Bottom 0.254: IC17.4 5.08,28.42 5.08,53.44 4.45,54.08 v4.45,67.16 | v53.98,77.95 v53.98,60.81 | IC22.28 12.7,69.7 v12.7,79.22 | v111.76,43.66 111.76,39.22 112.39,38.58 R1.1 | v84.45,76.68 84.45,67.79 85.72,66.52 85.72,58.27 87,57 v87,43.66 | v37.47,79.22 v37.47,76.68 | v81.28,76.68 P2.5
FLAGCLK  (via drill 0.3)
  Top 0.254: IC21.11 v103.5,15.09 102.87,15.09 101.6,16.36 IC21.3
  Bottom 0.254: R9.2 101.09,12.67 v103.5,15.09
FLATCH  (via drill 0.3)
  Top 0.254: IC19.19 71.12,30.96 v84.45,30.96 | v84.45,18.9 IC20.2
  Bottom 0.254: v84.45,30.96 v84.45,18.9
FV  (via drill 0.3)
  Top 0.203: 104.52,15.72 107.19,15.72
  Top 0.254: v102.23,80.49 97.16,80.49 96.52,81.13 94.61,81.13 93.98,81.76 92.71,81.76 92.08,82.4 88.9,82.4 88.27,83.03 83.19,83.03 82.55,83.67 82.55,85.57 P2.6 | v114.3,43.92 113.28,44.93 v103.5,44.93 | v102.23,70.33 v102.23,76.68 | v102.23,16.99 103.5,15.72 104.52,15.72 | v109.86,14.45 108.58,14.45 107.31,15.72 107.19,15.72
  Bottom 0.203: 102.23,63.35 102.23,65.25 101.98,65.51 101.98,65.89
  Bottom 0.254: v109.86,14.45 111.76,16.36 111.76,23.34 115.57,27.15 115.57,39.85 114.3,41.12 v114.3,43.92 | v103.5,44.93 103.5,48.11 102.23,49.38 102.23,63.35 | 101.98,65.89 101.98,68.55 102.23,68.81 v102.23,70.33 | v102.23,76.68 v102.23,80.49 | R10.2 100.97,15.72 v102.23,16.99
FVOUT  (via drill 0.3)
  Top 0.203: 87.63,18.26 91.06,18.26 | 92.71,18.26 96.39,18.26
  Top 0.254: IC21.2 97.16,17.63 96.52,18.26 96.39,18.26 | v85.09,35.41 83.82,35.41 81.92,37.31 IC19.21 | v85.09,18.26 87.63,18.26 | 91.06,18.26 92.71,18.26
  Bottom 0.254: v85.09,35.41 85.09,33.5 85.72,32.87 85.72,18.9 v85.09,18.26
GND  (via drill 0.3)
  Top 0.203: 131.44,44.3 131.44,47.47 | 122.56,24.61 122.56,26.52 | 121.28,24.61 121.28,26.52
  Top 0.254: IC20.1 v90.81,20.17 | IC20.3 v90.81,17.63 | v93.34,18.9 IC20.15 | IC34.19 v121.92,44.3 | 52.65,14.45 52.65,14.4 IC9.10
  Top 0.61: C21.1 v102.87,20.8 | C20.1 v92.08,22.07 | IC21.7 v101.6,11.28 | IC7.8 v111.89,30.96 | v95.76,30.96 IC6.7 | IC8.1 33.71,14.45 v34.42,14.45 | IC15.10 37.41,14.45 v36.7,14.45 | 52.65,14.45 v51.94,14.45 | IC16.19 v78.11,6.2 | IC15.19 v47.62,6.2 | C4.1 v100.2,40.49 | v88.27,29.06 C2.1 | IC20.8 v90.81,11.28 | v90.81,15.09 IC20.5 IC20.6 | IC2.3 91.12,38.9 v91.44,39.22 | IC4.3 89.22,31.28 v88.9,30.96 | IC16.10 67.36,14.4 v67.31,14.45 | C8.1 v92.96,67.41 | C5.1 v113.03,41.76 | v95.89,29.06 C1.1 | C6.1 83.17,6.18 v83.19,6.2 | C14.1 v50.8,7.47 | v66.04,5.44 C13.1 | v93.09,5.56 LED1.C | C9.1 v107.7,68.68 | IC27.13 IC27.12 IC27.11 v127.13,53.82 | v119.38,49.25 119.38,49.91 IC27.7 | IC35.5 IC35.6 IC35.7 IC35.8 | v131.44,20.55 IC35.10 | IC34.10 v132.08,37.69 | IC29.8 v144.15,38.96 | IC30.8 147.42,76.68 v148.21,76.68 | IC31.8 146.91,63.22 v147.45,63.22 | v136.14,76.68 135.36,76.68 IC32.8 | v135.25,57.89 IC33.8 | v145.03,25.76 C35.1 | C39.1 v124.46,77.57 | C15.2 v15.75,4.93 | C16.2 v86.36,6.96 | IC3.3 90.22,35.03 v91.06,35.03 | IC1.3 112.71,27.21 v112.9,27.41 | IC5.2 v106.68,27.79 | C33.1 110.11,69.71 v110.11,70.97 | IC25.8 123.19,63.35 v123.95,63.35 | IC9.1 64.14,14.45 v64.9,14.45 | C23.2 v17.78,46.84 | IC8.10 22.17,14.45 v21.46,14.45 | C42.1 118.73,44.17 v117.09,44.17
  Bottom 0.203: 69.22,93.83 69.22,97 | 98.42,62.71 98.42,66.52 | 108.58,94.34 108.58,97 | 108.58,62.71 108.58,66.52 | 135.25,29.06 135.25,32.87 | 136.53,22.71 136.53,26.52 | 120.02,22.07 120.02,25.88 | 130.18,22.07 130.18,25.25 | 142.88,29.44 142.88,32.23 | 137.79,23.34 137.79,26.14 | 139.06,23.22 139.06,26.01 | 141.6,23.22 141.6,26.01 | 127.64,11.66 127.64,15.47 | 128.91,11.66 128.91,15.47 | 130.18,11.66 130.18,15.47
  other vias: 130.81,51.28 131.44,56.36 131.44,43.66 121.28,27.15 125.09,20.17 128.27,20.17
  pour Bottom (isolate 0.254, rank 6): 0,100.18 0,-0.15 160.66,-0.15 160.66,100.18
  pour Top (isolate 0.254): 130.18,63.35 135.89,63.35 135.89,57 134.62,55.73 134.62,49.38 133.99,48.74 133.99,46.84 132.08,46.84 132.08,39.22 131.44,38.58 130.18,38.58 130.18,39.22 130.81,39.85 130.81,46.84 127.64,46.84 127.64,48.74 129.54,50.65 129.54,63.35
  pour Top (isolate 0.254): 120.02,27.79 123.83,27.79 123.83,22.71 130.18,22.71 130.18,20.17 131.44,18.9 124.46,18.9 122.56,20.8 121.92,20.8 120.02,22.71
HWA2  (via drill 0.3)
  Top 0.254: IC35.4 v123.83,27.15
  Bottom 0.254: 135.79,24.61 IC28.7 135.89,25.88 135.25,26.52 131.44,26.52 130.81,27.15 v123.83,27.15
HWA7  (via drill 0.3)
  Top 0.254: v136.53,19.53 130.81,19.53 130.18,20.17 IC35.9 130.18,23.98 132.08,25.88 132.08,27.15 v132.72,27.79
  Bottom 0.254: v132.72,27.79 133.99,27.79 134.62,28.42 IC28.9
IBUS0  (via drill 0.3)
  Top 0.254: v27.3,81.76 27.94,82.4 36.83,82.4 38.1,83.67 P3.21 | IC22.13 v24.13,58.27 | IC15.18 v46.35,6.2 48.9,8.74 v51.44,8.74 | v32.38,12.55 IC8.2 | v51.44,43.66 v19.05,43.66
  Bottom 0.254: v24.13,58.27 24.13,60.81 24.77,61.44 24.77,79.22 v27.3,81.76 | v46.35,6.2 41.91,10.64 34.29,10.64 v32.38,12.55 | v19.05,43.66 IC22.13 | v51.44,8.74 51.44,9.88 51.05,10.26 51.05,18.52 51.44,18.9 51.44,25.25 50.8,25.88 50.8,32.23 51.44,32.87 v51.44,43.66
IBUS1  (via drill 0.3)
  Top 0.254: IC15.17 v45.09,6.2 48.26,9.37 v50.8,9.37 | v31.11,12.55 IC8.3 | v49.53,43.03 v22.23,43.03 | P3.22 36.83,85.57 36.83,83.67 36.2,83.03 27.3,83.03 26.04,81.76 v24.77,81.76
  Bottom 0.254: v24.77,81.76 23.5,80.49 23.5,62.71 IC22.14 22.23,60.17 v22.23,43.03 | v45.09,6.2 41.27,10.01 33.66,10.01 v31.11,12.55 | v49.53,43.03 49.53,18.26 50.42,17.37 50.42,9.75 v50.8,9.37
IBUS2  (via drill 0.3)
  Top 0.254: IC22.15 20.32,62.08 v24.13,62.08 | P3.23 40.64,83.67 38.1,81.13 v25.4,81.13 | v43.81,6.2 IC15.16 | v29.84,12.55 IC8.4 | v3.17,19.53 5.71,16.99 v29.21,16.99 | v3.81,55.09 v17.78,55.09
  Bottom 0.254: v24.13,62.08 24.13,79.86 v25.4,81.13 | v43.81,6.2 40.64,9.37 33.02,9.37 v29.84,12.55 29.84,16.36 v29.21,16.99 | v3.17,19.53 3.17,53.19 3.81,53.82 v3.81,55.09 | v17.78,55.09 17.78,59.54 IC22.15
IBUS3  (via drill 0.3)
  Top 0.254: IC22.17 20.32,64.62 v26.67,64.62 | v42.55,6.2 IC15.15 | v28.57,12.55 IC8.5 | P3.24 39.37,85.57 39.37,83.67 37.47,81.76 v28.57,81.76
  Bottom 0.254: v42.55,6.2 40.01,8.74 32.38,8.74 v28.57,12.55 28.57,13.82 26.67,15.72 26.67,38.58 26.04,39.22 26.04,58.9 26.67,59.54 v26.67,64.62 26.67,77.32 28.57,79.22 v28.57,81.76
IBUS4  (via drill 0.3)
  Top 0.254: P3.25 43.18,83.67 39.37,79.86 v27.94,79.86 | v41.27,6.2 IC15.14 | v27.3,12.55 IC8.6 | v26.04,65.89 IC22.18
  Bottom 0.254: v41.27,6.2 39.37,8.1 31.75,8.1 v27.3,12.55 27.3,13.82 26.04,15.09 26.04,37.95 25.4,38.58 25.4,59.54 26.04,60.17 v26.04,65.89 26.04,77.95 v27.94,79.86
IBUS5  (via drill 0.3)
  Top 0.254: IC22.19 20.32,67.16 v25.4,67.16 | v40.01,6.2 IC15.13 | v26.04,12.55 IC8.7 | v27.3,80.49 38.73,80.49 41.91,83.67 41.91,85.57 P3.26
  Bottom 0.254: v27.3,80.49 25.4,78.59 v25.4,67.16 25.4,60.81 24.77,60.17 24.77,37.95 25.4,37.31 25.4,14.45 26.04,13.82 v26.04,12.55 31.11,7.47 38.73,7.47 v40.01,6.2
IBUS6  (via drill 0.3)
  Top 0.254: IC23.13 v51.44,58.27 | v38.73,6.2 IC15.12 | v24.77,12.55 IC8.8 | v24.13,55.09 v44.45,55.09 | v52.7,81.76 v45.72,81.76
  Bottom 0.254: v38.73,6.2 38.1,6.83 30.48,6.83 v24.77,12.55 24.77,36.68 24.13,37.31 v24.13,55.09 | v44.45,55.09 IC23.13 | v45.72,81.76 P3.27 | v51.44,58.27 51.44,80.49 v52.7,81.76
IBUS7  (via drill 0.3)
  Top 0.254: v52.07,60.81 IC23.14 | v37.47,6.2 IC15.11 | v23.5,12.55 IC8.9 | v23.5,54.46 v52.07,54.46 | v52.07,77.32 v44.45,77.32
  Bottom 0.254: v37.47,6.2 29.84,6.2 v23.5,12.55 23.5,13.82 24.13,14.45 24.13,36.04 23.5,36.68 v23.5,54.46 | v52.07,54.46 v52.07,60.81 v52.07,77.32 | P3.28 44.45,85.57 v44.45,77.32
IBUS8  (via drill 0.3)
  Top 0.254: v52.07,82.4 50.16,82.4 P3.29 | IC23.15 46.35,58.9 v50.8,58.9 | v62.87,10.64 IC9.2 | IC16.18 v76.83,6.2 78.11,7.47 v83.19,7.47 | v83.19,79.22 69.85,79.22 69.22,79.86 67.94,79.86 67.31,80.49 v50.8,80.49